# Altium schematic sheet 语音识别系统.SchDoc
size A4
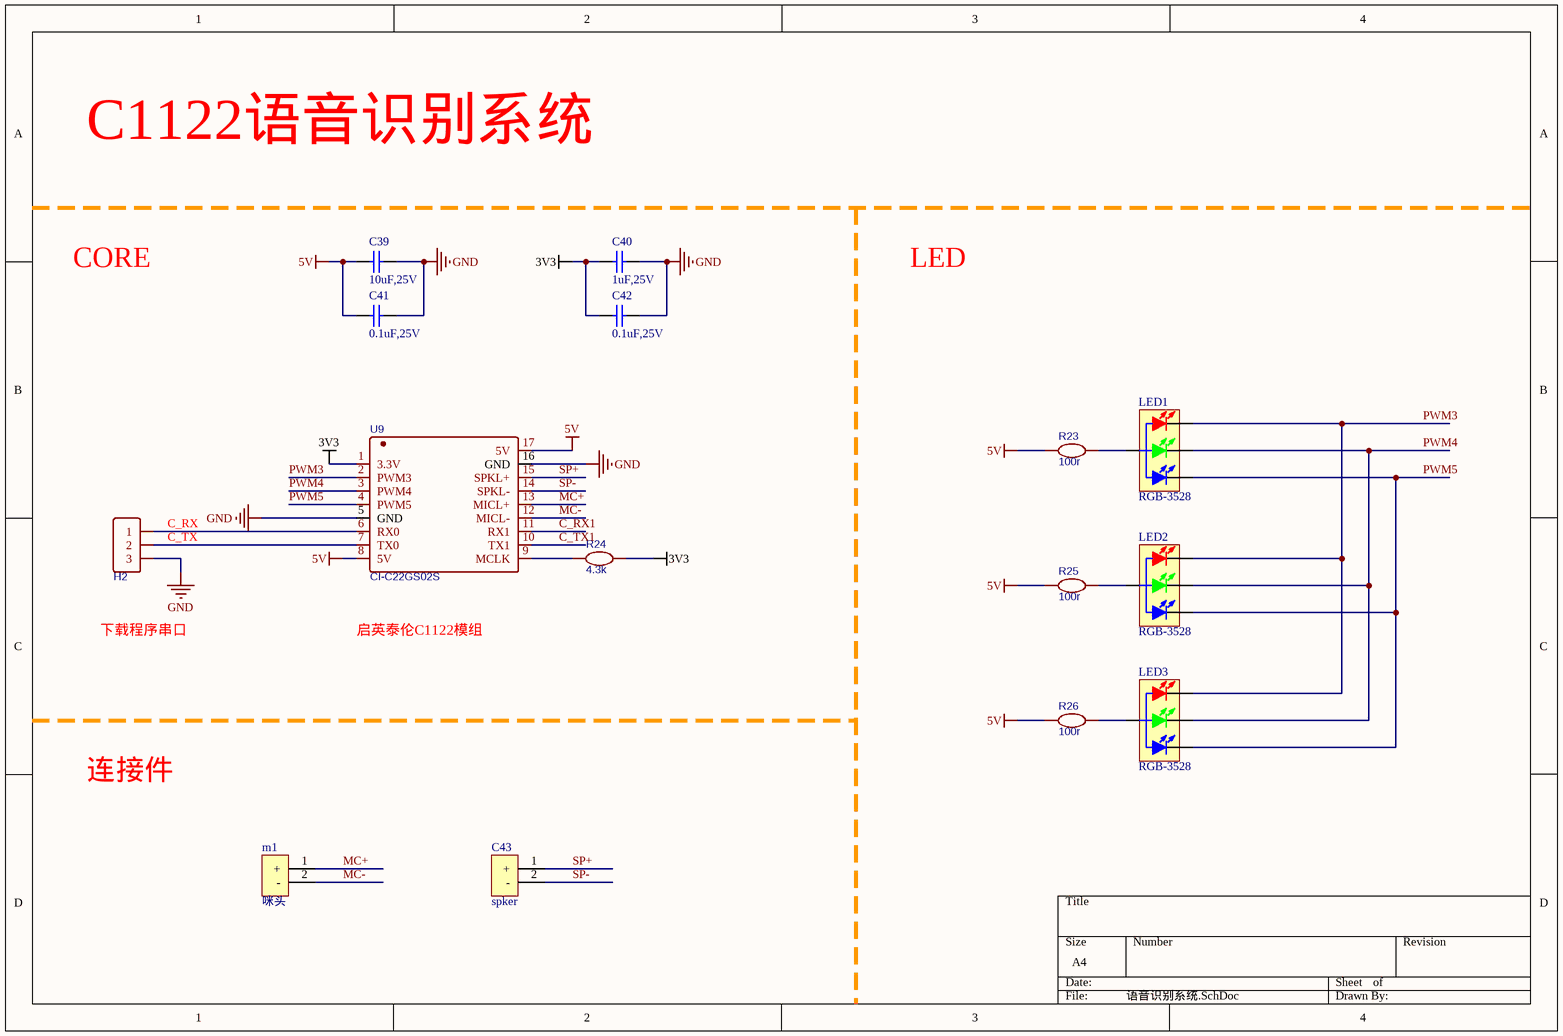
[diagram p0: 语音识别系统.SchDoc]

## Parts
C39  value 10uF,25V  [0402_C]  (hidden comment: Cap)
C40  value 1uF,25V  [0402_C]  (hidden comment: Cap)
C41  value 0.1uF,25V  [0402_C]  (hidden comment: Cap)
C42  value 0.1uF,25V  [0402_C]  (hidden comment: Cap)
C43  spker  [XH2.54A-2]
H2  HDR-F-2.54_1x3  [XH2.54A-3]  (value not drawn)
LED1  RGB-3528  [LED-TH_4P-BD6.9-P1.27-R]
LED2  RGB-3528  [LED-TH_4P-BD6.9-P1.27-R]
LED3  RGB-3528  [LED-TH_4P-BD6.9-P1.27-R]
m1  咪头  [MIC-TH_BD6.0-P1.90-D0.4-L-RD]
R23  100r  [0402_R]
R24  4.3k  [0402_R]
R25  100r  [0402_R]
R26  100r  [0402_R]
U9  CI-C22GS02S  [SMD-17_L20.0-W1.80-CI-C22GS02S]

## Nets
3V3: C40.1 C42.1 R24.1 U9.1(3.3V)
5V: C39.1 C41.1 R23.2 R25.2 R26.2 U9.8(5V) U9.17(5V)
GND: C39.2 C40.2 C41.2 C42.2 H2.3 U9.5(GND) U9.16(GND)
C_RX1: U9.11(RX1)
C_TX1: U9.10(TX1)
MC+: m1.1(+) U9.13(MICL+)
MC-: m1.2(-) U9.12(MICL-)
PWM3: LED1.1(RED_K) LED2.1(RED_K) LED3.1(RED_K) U9.2(PWM3)
PWM4: LED1.3(GREEN_K) LED2.3(GREEN_K) LED3.3(GREEN_K) U9.3(PWM4)
PWM5: LED1.4(BULE_K) LED2.4(BULE_K) LED3.4(BULE_K) U9.4(PWM5)
SP+: C43.1(+) U9.15(SPKL+)
SP-: C43.2(-) U9.14(SPKL-)
NetH2_1: H2.1 U9.6(RX0)
NetH2_2: H2.2 U9.7(TX0)
NetLED1_2: LED1.2(A) R23.1
NetLED2_2: LED2.2(A) R25.1
NetLED3_2: LED3.2(A) R26.1
NetR24_2: R24.2 U9.9(MCLK)

## Notes on the sheet
- C1122语音识别系统
- CORE
- LED
- (near H2) C_RX
- (near H2) C_TX
- 下载程序串口
- 启英泰伦C1122模组
- 连接件

## Library data of the parts
C39-C42 = T_Cap_0603_0.1uF_25V_X5R: 贴片电容; Part Typer: X5R; Solder: SMD; Withstand Voltage: 25V; Tolerance: 10%; Schematic Path: X:\Database\Schematic Library.Schlib; Part Number: T_Cap_0603_0.1uF_25V_X5R; LibRef: T_Cap_0603_0.1uF_25V_X5R
C43 = SPK
H2 = HDR-F-2.54_1x3: Contributor: LCEDA_Lib; BOM_Supplier Part: C146690; BOM_Supplier: LCSC; spicePre: H; spiceSymbolName: HDR-F-2.54_1x3
LED1-LED3 = LED-RGB-3528: 三基色LED; 版权归属: 源创客; BOM名称: 三基色LED; 学习资源: www.ooocke.com
m1 = mic
R23-R26 = 100k: nameAlias: Value(Ω); Contributor: LCEDA_Lib; spicePre: R; spiceSymbolName: R_0603_EU
U9 = CI-C22GS02S: BOM_Manufacturer: Chiplntelli(启英泰伦); Contributor: LCSC; BOM_Supplier: LCSC; BOM_Supplier Part: C2759836; BOM_Manufacturer Part: CI-C22GS02S; BOM_JLCPCB Part Class: Extended Part; spicePre: U; spiceSymbolName: CI-C22GS02S